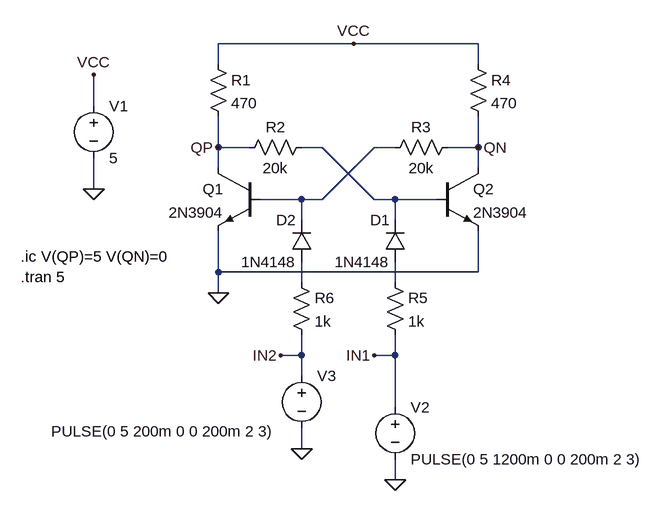
[diagram p0: schematic bistable_npn.asc]
bistable_npn.asc, the LTspice schematic file:
Version 4
SHEET 1 880 680
WIRE 240 -80 32 -80
WIRE 432 -80 240 -80
WIRE 32 -48 32 -80
WIRE 432 -48 432 -80
WIRE -160 16 -160 -32
WIRE 32 80 32 32
WIRE 80 80 32 80
WIRE 192 80 160 80
WIRE 304 80 272 80
WIRE 432 80 432 32
WIRE 432 80 384 80
WIRE 32 112 32 80
WIRE 432 112 432 80
WIRE -160 144 -160 96
WIRE 160 160 96 160
WIRE 192 160 272 80
WIRE 192 160 160 160
WIRE 272 160 192 80
WIRE 304 160 272 160
WIRE 368 160 304 160
WIRE 160 192 160 160
WIRE 304 192 304 160
WIRE 32 272 32 208
WIRE 432 272 432 208
WIRE 432 272 32 272
WIRE 160 288 160 256
WIRE 304 288 304 256
WIRE 32 304 32 272
WIRE 160 400 160 368
WIRE 160 400 128 400
WIRE 304 400 304 368
WIRE 304 400 272 400
WIRE 160 432 160 400
WIRE 304 480 304 400
WIRE 160 544 160 512
WIRE 304 592 304 560
FLAG 32 304 0
FLAG 240 -80 VCC
FLAG 32 80 QP
FLAG 432 80 QN
FLAG -160 144 0
FLAG -160 -32 VCC
FLAG 304 592 0
FLAG 272 400 IN1
FLAG 160 544 0
FLAG 128 400 IN2
SYMBOL npn 96 112 M0
SYMATTR InstName Q1
SYMATTR Value 2N3904
SYMBOL npn 368 112 R0
SYMATTR InstName Q2
SYMATTR Value 2N3904
SYMBOL res 16 -64 R0
SYMATTR InstName R1
SYMATTR Value 470
SYMBOL res 176 64 R90
WINDOW 0 0 56 VBottom 2
WINDOW 3 32 56 VTop 2
SYMATTR InstName R2
SYMATTR Value 20k
SYMBOL res 400 64 R90
WINDOW 0 0 56 VBottom 2
WINDOW 3 32 56 VTop 2
SYMATTR InstName R3
SYMATTR Value 20k
SYMBOL res 416 -64 R0
SYMATTR InstName R4
SYMATTR Value 470
SYMBOL voltage -160 0 R0
WINDOW 123 0 0 Left 0
WINDOW 39 0 0 Left 0
SYMATTR InstName V1
SYMATTR Value 5
SYMBOL voltage 304 464 R0
WINDOW 123 0 0 Left 0
WINDOW 39 0 0 Left 0
SYMATTR InstName V2
SYMATTR Value PULSE(0 5 1200m 0 0 200m 2 3)
SYMBOL res 288 272 R0
SYMATTR InstName R5
SYMATTR Value 1k
SYMBOL diode 320 256 R180
WINDOW 0 24 64 Left 2
WINDOW 3 24 0 Left 2
SYMATTR InstName D1
SYMATTR Value 1N4148
SYMBOL res 144 272 R0
SYMATTR InstName R6
SYMATTR Value 1k
SYMBOL diode 176 256 R180
WINDOW 0 24 64 Left 2
WINDOW 3 24 0 Left 2
SYMATTR InstName D2
SYMATTR Value 1N4148
SYMBOL voltage 160 416 R0
WINDOW 123 0 0 Left 0
WINDOW 39 0 0 Left 0
WINDOW 3 -385 101 Left 2
SYMATTR InstName V3
SYMATTR Value PULSE(0 5 200m 0 0 200m 2 3)
TEXT -272 248 Left 2 !.ic V(QP)=5 V(QN)=0\n.tran 5

The netlist it stands for:
* bistable_npn.asc
Q1 QP N002 0 0 2N3904
Q2 QN N001 0 0 2N3904
R1 VCC QP 470
R2 N001 QP 20k
R3 QN N002 20k
R4 VCC QN 470
V1 VCC 0 5
V2 IN1 0 PULSE(0 5 1200m 0 0 200m 2 3)
R5 N004 IN1 1k
D1 N004 N001 1N4148
R6 N003 IN2 1k
D2 N003 N002 1N4148
V3 IN2 0 PULSE(0 5 200m 0 0 200m 2 3)
.model D D
.lib standard.dio
.model NPN NPN
.model PNP PNP
.lib standard.bjt
.ic V(QP)=5 V(QN)=0
.tran 5
.backanno
.end